# Altium schematic sheet POWER_2.2.SchDoc
size A4
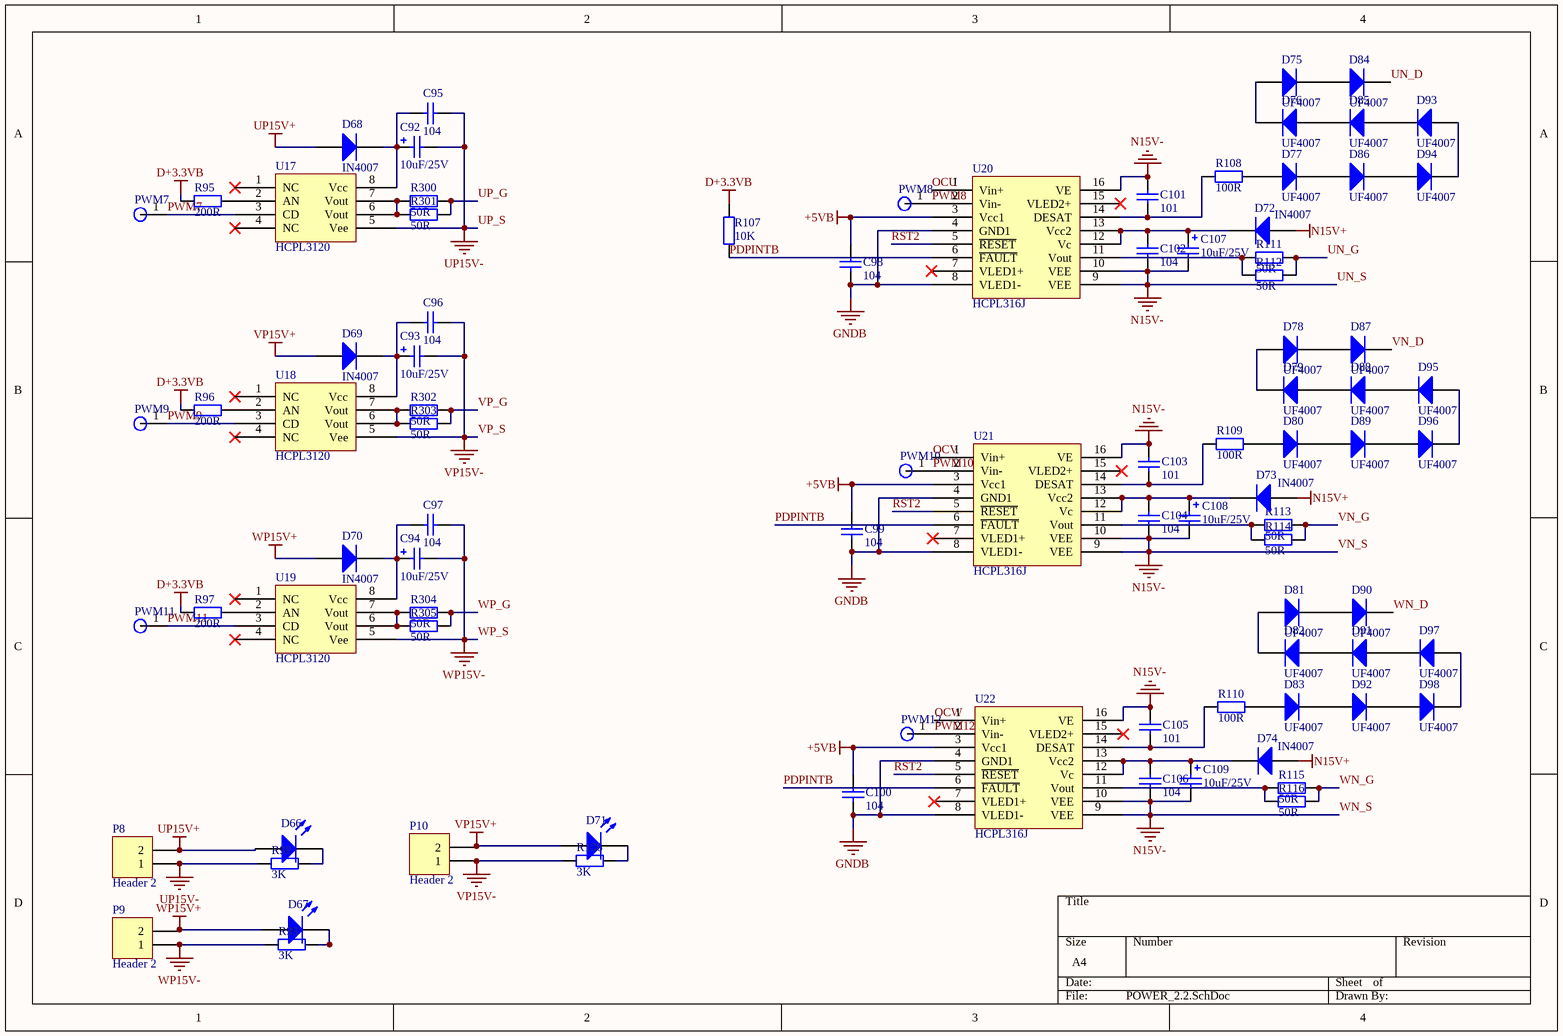
[diagram p0: POWER_2.2.SchDoc]

## Parts
C92  10uF/25V  [C_10UF/25V]
C93  10uF/25V  [C_10UF/25V]
C94  10uF/25V  [C_10UF/25V]
C95  104  [C2012-0805]
C96  104  [C2012-0805]
C97  104  [C2012-0805]
C98  104  [C2012-0805]
C99  104  [C2012-0805]
C100  104  [C2012-0805]
C101  101  [Rad-0.2]
C102  104  [C2012-0805]
C103  101  [Rad-0.2]
C104  104  [C2012-0805]
C105  101  [Rad-0.2]
C106  104  [C2012-0805]
C107  10uF/25V  [C_10UF/25V]
C108  10uF/25V  [C_10UF/25V]
C109  10uF/25V  [C_10UF/25V]
D66  (no value)  [LED-SMD]
D67  (no value)  [LED-SMD]
D68  IN4007  [DIODE4007]
D69  IN4007  [DIODE4007]
D70  IN4007  [DIODE4007]
D71  (no value)  [LED-SMD]
D72  IN4007  [DIODE4007]
D73  IN4007  [DIODE4007]
D74  IN4007  [DIODE4007]
D75  UF4007  [DIODE4007]
D76  UF4007  [DIODE4007]
D77  UF4007  [DIODE4007]
D78  UF4007  [DIODE4007]
D79  UF4007  [DIODE4007]
D80  UF4007  [DIODE4007]
D81  UF4007  [DIODE4007]
D82  UF4007  [DIODE4007]
D83  UF4007  [DIODE4007]
D84  UF4007  [DIODE4007]
D85  UF4007  [DIODE4007]
D86  UF4007  [DIODE4007]
D87  UF4007  [DIODE4007]
D88  UF4007  [DIODE4007]
D89  UF4007  [DIODE4007]
D90  UF4007  [DIODE4007]
D91  UF4007  [DIODE4007]
D92  UF4007  [DIODE4007]
D93  UF4007  [DIODE4007]
D94  UF4007  [DIODE4007]
D95  UF4007  [DIODE4007]
D96  UF4007  [DIODE4007]
D97  UF4007  [DIODE4007]
D98  UF4007  [DIODE4007]
P8  Header 2  [HDR1X2]
P9  Header 2  [HDR1X2]
P10  Header 2  [HDR1X2]
R95  200R  [R2012-0805]
R96  200R  [R2012-0805]
R97  200R  [R2012-0805]
R98  3K  [R2012-0805]
R99  3K  [R2012-0805]
R106  3K  [R2012-0805]
R107  10K  [R2012-0805]
R108  100R  [R2012-0805]
R109  100R  [R2012-0805]
R110  100R  [R2012-0805]
R111  50R  [R2012-0805]
R112  50R  [R2012-0805]
R113  50R  [R2012-0805]
R114  50R  [R2012-0805]
R115  50R  [R2012-0805]
R116  50R  [R2012-0805]
R300  50R  [R2012-0805]
R301  50R  [R2012-0805]
R302  50R  [R2012-0805]
R303  50R  [R2012-0805]
R304  50R  [R2012-0805]
R305  50R  [R2012-0805]
T32  PWM8  [PIN1]
T33  PWM10  [PIN1]
T34  PWM12  [PIN1]
TP6  PWM7  [PIN1]
TP7  PWM9  [PIN1]
TP8  PWM11  [PIN1]
U17  HCPL3120  [HCPL3120]
U18  HCPL3120  [HCPL3120]
U19  HCPL3120  [HCPL3120]
U20  HCPL316J  [HCPL316J]
U21  HCPL316J  [HCPL316J]
U22  HCPL316J  [HCPL316J]

## Nets
+5VB: C98.2 C99.2 C100.2 U20.3(Vcc1) U21.3(Vcc1) U22.3(Vcc1)
D+3.3VB: R95.2 R96.2 R97.2 R107.2
GNDB: C98.1 C99.1 C100.1 U20.4(GND1) U20.8(VLED1-) U21.4(GND1) U21.8(VLED1-) U22.4(GND1) U22.8(VLED1-)
N15V+: D72.1(A) D73.1(A) D74.1(A)
UN_S: C101.2 C102.1 C103.2 C104.1 C105.2 C106.1 C107.2 C108.2 C109.2 U20.9(VEE) U20.10(VEE) U20.16(VE) U21.9(VEE) U21.10(VEE) U21.16(VE) U22.9(VEE) U22.10(VEE) U22.16(VE)  [also labelled N15V-, VN_S, WN_S]
UP15V+: D66.1(A) D68.1(A) P8.2
UP_S: C92.2 C95.2 P8.1 R98.1 U17.5(Vee)  [also labelled UP15V-]
VP15V+: D69.1(A) D71.1(A) P10.2
VP_S: C93.2 C96.2 P10.1 R106.1 U18.5(Vee)  [also labelled VP15V-]
WP15V+: D67.1(A) D70.1(A) P9.2
WP_S: C94.2 C97.2 P9.1 R99.1 U19.5(Vee)  [also labelled WP15V-]
OCU: U20.1(Vin+)
OCV: U21.1(Vin+)
OCW: U22.1(Vin+)
PDPINTB: R107.1 U20.6(~{FAULT}) U21.6(~{FAULT}) U22.6(~{FAULT})
PWM7: TP6.1(A) U17.3(CD)
PWM8: T32.1(A) U20.2(Vin-)
PWM9: TP7.1(A) U18.3(CD)
PWM10: T33.1(A) U21.2(Vin-)
PWM11: TP8.1(A) U19.3(CD)
PWM12: T34.1(A) U22.2(Vin-)
RST2: U20.5(~{RESET}) U21.5(~{RESET}) U22.5(~{RESET})
UN_D: D84.2(K)
UN_G: R111.1 R112.1
UP_G: R300.1 R301.1
VN_D: D87.2(K)
VN_G: R113.1 R114.1
VP_G: R302.1 R303.1
WN_D: D90.2(K)
WN_G: R115.1 R116.1
WP_G: R304.1 R305.1
NetC92_1: C92.1 C95.1 D68.2(K) U17.8(Vcc)
NetC93_1: C93.1 C96.1 D69.2(K) U18.8(Vcc)
NetC94_1: C94.1 C97.1 D70.2(K) U19.8(Vcc)
NetC101_1: C101.1 R108.2 U20.14(DESAT)
NetC102_2: C102.2 C107.1 D72.2(K) U20.12(Vc) U20.13(Vcc2)
NetC103_1: C103.1 R109.2 U21.14(DESAT)
NetC104_2: C104.2 C108.1 D73.2(K) U21.12(Vc) U21.13(Vcc2)
NetC105_1: C105.1 R110.2 U22.14(DESAT)
NetC106_2: C106.2 C109.1 D74.2(K) U22.12(Vc) U22.13(Vcc2)
NetD66_2: D66.2(K) R98.2
NetD67_2: D67.2(K) R99.2
NetD71_2: D71.2(K) R106.2
NetD75_1: D75.1(A) D76.2(K)
NetD75_2: D75.2(K) D84.1(A)
NetD76_1: D76.1(A) D85.2(K)
NetD77_1: D77.1(A) R108.1
NetD77_2: D77.2(K) D86.1(A)
NetD78_1: D78.1(A) D79.2(K)
NetD78_2: D78.2(K) D87.1(A)
NetD79_1: D79.1(A) D88.2(K)
NetD80_1: D80.1(A) R109.1
NetD80_2: D80.2(K) D89.1(A)
NetD81_1: D81.1(A) D82.2(K)
NetD81_2: D81.2(K) D90.1(A)
NetD82_1: D82.1(A) D91.2(K)
NetD83_1: D83.1(A) R110.1
NetD83_2: D83.2(K) D92.1(A)
NetD85_1: D85.1(A) D93.2(K)
NetD86_2: D86.2(K) D94.1(A)
NetD88_1: D88.1(A) D95.2(K)
NetD89_2: D89.2(K) D96.1(A)
NetD91_1: D91.1(A) D97.2(K)
NetD92_2: D92.2(K) D98.1(A)
NetD93_1: D93.1(A) D94.2(K)
NetD95_1: D95.1(A) D96.2(K)
NetD97_1: D97.1(A) D98.2(K)
NetR95_1: R95.1 U17.2(AN)
NetR96_1: R96.1 U18.2(AN)
NetR97_1: R97.1 U19.2(AN)
NetR111_2: R111.2 R112.2 U20.11(Vout)
NetR113_2: R113.2 R114.2 U21.11(Vout)
NetR115_2: R115.2 R116.2 U22.11(Vout)
NetR300_2: R300.2 R301.2 U17.6(Vout) U17.7(Vout)
NetR302_2: R302.2 R303.2 U18.6(Vout) U18.7(Vout)
NetR304_2: R304.2 R305.2 U19.6(Vout) U19.7(Vout)

Not connected (* = marked no-connect by the designer): U17 1(NC)* 4(NC)*; U18 1(NC)* 4(NC)*; U19 1(NC)* 4(NC)*; U20 7(VLED1+)* 15(VLED2+)*; U21 7(VLED1+)* 15(VLED2+)*; U22 7(VLED1+)* 15(VLED2+)*

## Library data of the parts
C92-C94 C107-C109 = Cap tan: 钽电解; value: 10uF/25V
C95-C106 = Cap: 普通电容
  C95-C100 C102 C104 C106: Value: 104
  C101 C103 C105: Value: 101
D66 D67 D71 = LED
D68-D70 D72-D98 = Diode IN4007: 普通整流二极管
  D68-D70 D72-D74: value: IN4007
  D75-D98: value: UF4007
P8-P10 = Header 2: Header, 2-Pin; LatestRevisionDate: 17-Jul-2002; LatestRevisionNote: Re-released for DXP Platform.; Publisher: Altium Limited
R95-R99 R106-R116 R300-R305 = Res
  R95-R97: Value: 200R
  R98 R99 R106: Value: 3K
  R107: Value: 10K
  R108-R110: Value: 100R
  R111-R116 R300-R305: Value: 50R
T32-T34 TP6-TP8 = TP: 测试脚